# Altium schematic sheet LOAD.SchDoc: =DocumentName
size 297 x 209 mm; CompanyName: "AS Manufacturing" LLC; Organization: "AS Manufacturing" LLC; Address1: 5 Sklyarenka St.; Address2: Kyiv 04073; Address3: Ukraine; Address4: https://ajax.systems/en/; DocumentNumber: 2; SheetNumber: 2; SheetTotal: 7; Template_version: 1.0.1
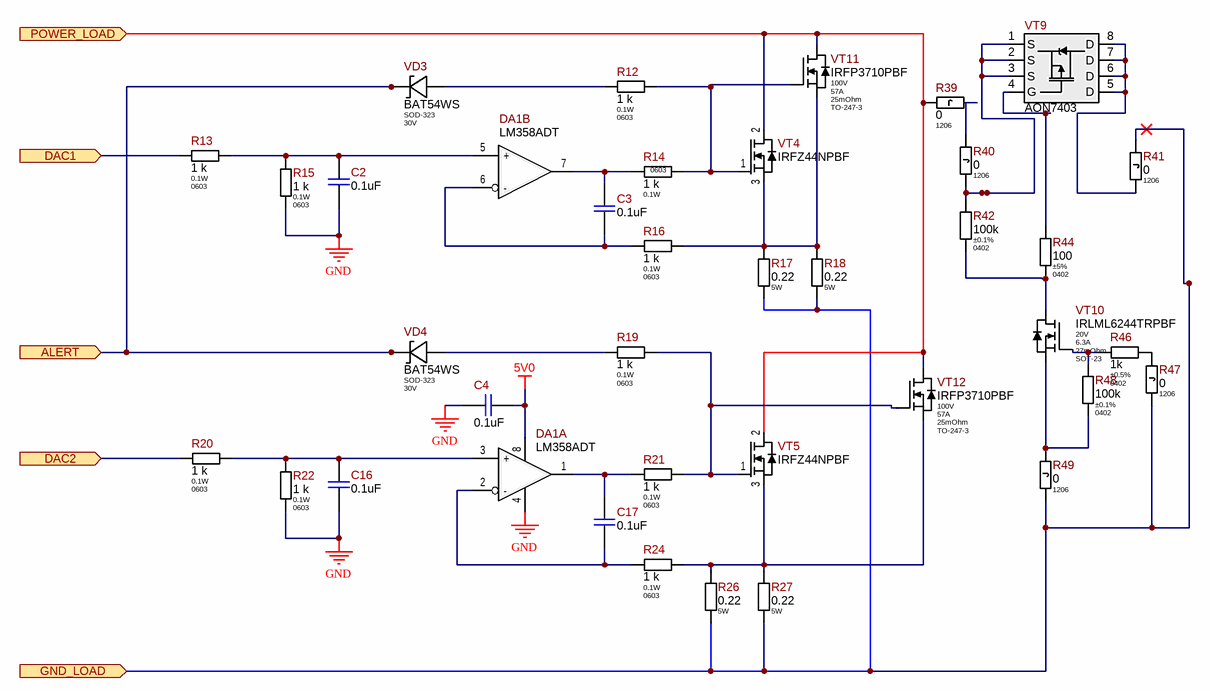
[diagram p0: LOAD.SchDoc]

## Parts
C2  0.1uF  [C0603(1608)]
C3  0.1uF  [C0603(1608)]
C4  0.1uF  [C0603(1608)]
C16  0.1uF  [C0603(1608)]
C17  0.1uF  [C0603(1608)]
DA1  LM358ADT  [SOIC8]  (parts A,B of 2)
R12  1 k  Power Rating: 0.1W  Package/Case: 0603  [R0603]
R13  1 k  Power Rating: 0.1W  Package/Case: 0603  [R0603]
R14  1 k  Power Rating: 0.1W  Package/Case: 0603  [R0603]
R15  1 k  Power Rating: 0.1W  Package/Case: 0603  [R0603]
R16  1 k  Power Rating: 0.1W  Package/Case: 0603  [R0603]
R17  0.22  Power Rating: 5W  [R5W]
R18  0.22  Power Rating: 5W  [R5W]
R19  1 k  Power Rating: 0.1W  Package/Case: 0603  [R0603]
R20  1 k  Power Rating: 0.1W  Package/Case: 0603  [R0603]
R21  1 k  Power Rating: 0.1W  Package/Case: 0603  [R0603]
R22  1 k  Power Rating: 0.1W  Package/Case: 0603  [R0603]
R24  1 k  Power Rating: 0.1W  Package/Case: 0603  [R0603]
R26  0.22  Power Rating: 5W  [R5W]
R27  0.22  Power Rating: 5W  [R5W]
R39  Package: 1206  [R_ANY_CHIP_1206_MED]  (hidden comment: 0)
R40  Package: 1206  [R_ANY_CHIP_1206_MED]  (hidden comment: 0)
R41  Package: 1206  [R_ANY_CHIP_1206_MED]  (hidden comment: 0)
R42  Tolerance: ±0.1%  Package: 0402  [R_ANY_CHIP_0402_MED]  (hidden comment: 100k)
R44  Tolerance: ±5%  Package: 0402  [R_ANY_CHIP_0402_MED]  (hidden comment: 100)
R46  Tolerance: ±0.5%  Package: 0402  [R_ANY_CHIP_0402_MED]  (hidden comment: 1k)
R47  Package: 1206  [R_ANY_CHIP_1206_MED]  (hidden comment: 0)
R48  Tolerance: ±0.1%  Package: 0402  [R_ANY_CHIP_0402_MED]  (hidden comment: 100k)
R49  Package: 1206  [R_ANY_CHIP_1206_MED]  (hidden comment: 0)
VD3  BAT54WS  Package: SOD-323  Voltage: 30V  [SOD-323_MED]
VD4  BAT54WS  Package: SOD-323  Voltage: 30V  [SOD-323_MED]
VT4  IRFZ44NPBF  [TO-220]
VT5  IRFZ44NPBF  [TO-220]
VT9  AON7403  [DFN3X3]
VT10  Part Number: IRLML6244TRPBF  Vds: 20V  Id: 6.3A  Rds: 27mOhm  Package: SOT-23  [SOT-23_MED]  (hidden comment: IRLML6244)
VT11  Vds: 100V  Id: 57A  Rds: 25mOhm  [TO-247-3]  (hidden comment: IRFP3710PBF)
VT12  Vds: 100V  Id: 57A  Rds: 25mOhm  [TO-247-3]  (hidden comment: IRFP3710PBF)

## Ports
ALERT (in), DAC1 (in), DAC2 (in), GND_LOAD (in), POWER_LOAD (in)

## Nets
5V0: C4.1 DA1.8(V+)
GND: C2.2 C4.2 C16.2 DA1.4(V-) R15.1 R22.1
ALERT: VD3.CA VD4.CA ; port ALERT
DAC1: R13.1 ; port DAC1
DAC2: R20.1 ; port DAC2
GND_LOAD: R17.1 R18.1 R26.1 R27.1 R41.1 R47.2 R49.2 ; port GND_LOAD
POWER_LOAD: R39.1 VT4.2(D) VT5.2(D) VT11.2(D) VT12.2(D) ; port POWER_LOAD
NetC2_1: C2.1 DA1.5(+) R13.2 R15.2
NetC3_1: C3.1 DA1.7(Out) R14.1
NetC3_2: C3.2 DA1.6(-) R16.1
NetC16_1: C16.1 DA1.3(+) R20.2 R22.2
NetC17_1: C17.1 DA1.1(Out) R21.1
NetC17_2: C17.2 DA1.2(-) R24.1
NetR12_1: R12.1 VD3.AN
NetR12_2: R12.2 R14.2 VT4.1(G) VT11.1(G)
NetR16_2: R16.2 R17.2 R18.2 VT4.3(S) VT11.3(S)
NetR19_1: R19.1 VD4.AN
NetR19_2: R19.2 R21.2 VT5.1(G) VT12.1(G)
NetR24_2: R24.2 R26.2 R27.2 VT5.3(S) VT12.3(S)
NetR39_2: R39.2 R40.1
NetR40_2: R40.2 R42.1 VT9.1(S) VT9.2(S) VT9.3(S)
NetR41_2: R41.2 VT9.5(D) VT9.6(D) VT9.7(D) VT9.8(D)
NetR42_2: R42.2 R44.2 VT10.3(D)
NetR44_1: R44.1 VT9.4(G)
NetR46_1: R46.1 R47.1
NetR46_2: R46.2 R48.1 VT10.1(G)
NetR48_2: R48.2 R49.1 VT10.2(S)

## Notes on the sheet
- 1
- 2
- 3
- 4
- 5
- 6
- C
- D
- E
- F
- Назва проекту
- Мова
- UA
- Розробник
- Формат
- A4
- Версія
- Дата
- Лист
- /

## Library data of the parts
C2-C4 C16 C17 = 0.1uF  50V C0603: CAP CER 0.1UF 50V X7R 0603; Manufacturer: Samsung Electro-Mechanics; Manufacturer P/N: CL10B104KB8WPNC; Name Component: Capacitor Ceramic; Tolerance: ±10%; Operation Temperature: -55°C ~ 125°C; Library Path 1: Capacitors.SchLib; Notes: 06035C104K4T4A, 06035C104K4T2A; Part Number: 0.1uF  50V C0603; Value: 0.1uF; Temperature Coefficient: X7R; Power (V/A): 50V; Package/Case: C0603; Supplier Part Number 1: 1276-6854-2-ND; ComponentLink1Description: Datasheet; Supplier 1: Digi-key; ComponentLink1URL: https://www.samsungsem.com/resources/file/global/support/product_catalog/MLCC.pdf
DA1 = LM358ADT: IC OPAMP GP 2 CIRCUIT 8SOIC  1.1 MHz   3V...30V; Manufacturer: Texas Instruments; Manufacturer P/N: LM358ADR; Name Component: Comparators; Operation Temperature: 0°C ~ 70°C; Power (V/A): 3V ~ 30V; Library Path 1: Integrated Circuit.SchLib; ComponentLink1URL: https://www.st.com/content/ccc/resource/technical/document/datasheet/61/46/87/01/98/ed/44/c5/CD00000464.pdf/files/CD00000464.pdf/jcr:content/translations/en.CD00000464.pdf; ComponentLink1Description: Datasheet; Part Number: LM358ADT; Value: LM358ADT; Package/Case: 8-SOIC; Supplier 1: Kosmodrom; Supplier Part Number 1: LM358ADT
R12-R16 R19-R22 R24 = 1 k  R0603: RES SMD 1 k OHM  ±1% 1/10W 0603; Name Component: Resistror; Operation Temperature: -55℃ to 155℃; Temperature Coefficient: ±100 ppm/°C; Library Path 1: Resistor.SchLib; Part Number: 1 k  R0603; Value: 1 k; Tolerance: ±1%
R17 R18 R26 R27 = 47  RES_5W: Resistror 47 OHM  ±10% AXIAL  9.00mm x 22.00mm; Operation Temperature: -55℃ to 155℃; Temperature Coefficient: ±100 ppm/°C; Library Path 1: Resistor.SchLib; Part Number: 47  RES_5W; Name Component: Resistror; Value: 0.22; Tolerance: ±10%
R39-R41 R47 R49 = RCS12060000Z0EA: 0 Ohms Jumper, 1/2W 1206 Thick Film Resistor; Manufacturer: Vishay; Tolerance: 0.5%; Ajax_1C_ID: 28766; Ajax_1C_PN: 0R Jumper 1206 1/2W Resistors SMD RoHS; Ajax_1С_Status: Mass Production; Component Status: Released; Power Rating: 0.5W; Voltage: NONE; GUID_1C: 39e965f6-9d2d-11eb-ab70-0050569f2651; Value: 0; Part Number: RCS12060000Z0EA; Part Type: Thick Film; Component Type: SMD; Temperature Stability: NONE; Temperature Range: -55°C ~ 155°C; ComponentLink1URL: https://eu.mouser.com/datasheet/2/427/rcse3-1761771.pdf; Supplier 1: Mouser; Supplier Part Number 1: 71-RCS12060000Z0EA; Replacement: NONE; Price: 0.023; ComponentLink1Description: Datasheet
R42 R48 = WF04U1003BTL: 100 kOhms ±0.1%, 1/16W 0402 Thin Film Resistor; Manufacturer: Walsin Technology Corporation; Ajax_1C_ID: 137562; Ajax_1C_PN: 100k 0.1% 0402 62.5mW WF04U1003BTL Walsin Thin Film Resistors SMD RoHS; Ajax_1С_Status: Substitution; Component Status: Review; Power Rating: 0.062W; Voltage: 50V; Temperature Stability: ±25ppm/°C; Replacement: NONE; GUID_1C: d33922d2-2bd8-11f0-b984-00505699fadc; Value: 100k; Part Number: WF04U1003BTL; Part Type: Thin Film; Component Type: SMD; Temperature Range: -55°C ~ 155°C; ComponentLink1URL: https://www.passivecomponent.com/wp-content/uploads/thin_film/ASC_WFxxT&U.pdf; Supplier 1: Digi-Key; Supplier Part Number 1: 1292-WF04U1003BTLTR-ND; Price: 0.109; ComponentLink1Description: Datasheet
R44 = RC0402JR-07100RL: 100 Ohms ±5% 1/16W 0402 Thick Film Resistor; Manufacturer: Yageo; Ajax_1C_ID: 4879; Ajax_1C_PN: 100R 5% 0402 Resistors SMD RoHS; Ajax_1С_Status: Mass Production; Component Status: Released; Power Rating: 0.062W; Voltage: 50V; Temperature Stability: ±100ppm/°C; Replacement: NONE; GUID_1C: 955d0a6e-1239-11e4-b679-a45d36c4a9e5; Value: 100; Part Number: RC0402JR-07100RL; Part Type: Thick Film; Component Type: SMD; Temperature Range: -55°C ~ 155°C; ComponentLink1URL: https://eu.mouser.com/datasheet/2/447/PYu_RC_Group_51_RoHS_L_10-1664068.pdf; Supplier 1: Digi-Key; Supplier Part Number 1: 311-100JRTR-ND; Price: 0.00250459; ComponentLink1Description: Datasheet
R46 = RC0402DR-071KL: 1 kOhms ±0.5% 1/16W 0402 Thick Film Resistor; Manufacturer: Yageo; Ajax_1C_ID: 54619; Ajax_1C_PN: 1k 0.5% 0402 RC0402DR-071KL Resistors SMD RoHS; Ajax_1С_Status: Mass Production; Component Status: Released; Power Rating: 0.062W; Voltage: 50V; Temperature Stability: ±100ppm/°C; Replacement: NONE; GUID_1C: a470e21a-6423-11ed-a366-005056994834; Value: 1k; Part Number: RC0402DR-071KL; Part Type: Thick Film; Component Type: SMD; Temperature Range: -55°C ~ 155°C; ComponentLink1URL: https://www.yageo.com/upload/media/product/productsearch/datasheet/rchip/PYu-RC_Group_51_RoHS_L_12.pdf; Supplier 1: Digi-Key; Supplier Part Number 1: 13-RC0402DR-071KLTR-ND; Price: 0.015; ComponentLink1Description: Datasheet
VD3 VD4 = BAT54WS-7-F: Diode Schottky 30V 100mA, Fast Recovery 5ns, Low Leakage 2uA, SOD-323; Manufacturer: Diodes Incorporated; Ajax_1C_ID: 121513; Ajax_1C_PN: BAT54WS-7-F діод; Ajax_1С_Status: Mass Production; Component Status: Released; Marking: L9; Standard Lead Time: 8 Weeks; Vf: 500mV @ 30mA; Replacement: NONE; GUID_1C: e8a592fc-b25b-11ef-b620-0050569991a1; Part Number: BAT54WS-7-F; Supplier 1: Mouser; Supplier Part Number 1: 621-BAT54WS-F; ComponentLink1Description: Datasheet; ComponentLink1URL: https://eu.mouser.com/datasheet/2/115/DIOD_S_A0004140728_1-2542383.pdf; Part Type: Schottky; Component Type: SMD; Current: 100mA; Temperature Range: -65°C ~ 150°C; Price: 0.07452906
VT4 VT5 = IRFZ44NPBF: MOSFET N-CH 55V 49A TO220AB; Manufacturer: Infineon Technologies; Name Component: Transistor; Operation Temperature: -55°C ~ 175°C (TJ); Power Rating: 49A 55 В; Library Path 1: Transistors.SchLib; Part Number: IRFZ44NPBF; Value: IRFZ44NPBF; Package/Case: TO-220; Manufacturer P/N: IRFZ44NPBF; Supplier 1: Digi-key; Supplier Part Number 1: IRFZ44NPBF-ND; ComponentLink1Description: Datasheet; ComponentLink1URL: https://www.infineon.com/dgdl/irfz44npbf.pdf?fileId=5546d462533600a40153563b3a9f220d
VT9 = AON7403: P-Channel 30 V 11A (Ta), 29A (Tc) 3.1W (Ta), 25W (Tc) Surface Mount 8-DFN-EP (3x3); Manufacturer: Alpha & Omega Semiconductor Inc.; Name Component: Transistor; Operation Temperature: -55°C ~ 150°C (TJ); Power Rating: 30V 15A; Library Path 1: Transistors.SchLib; Part Number: AON7403; ComponentLink1URL: https://imrad.com.ua/userdata/modules/productFiles/XwMaVOEl_AON7403_ao.pdf; ComponentLink1Description: Datasheet; Supplier 1: Digi-key; Supplier Part Number 1: 785-1581-2-ND; Value: AON7403; Package/Case: DFN3x3; Manufacturer P/N: AON7403
VT10 = IRLML6244TRPBF: 20V, 6.3A max N-Channel HEXFET MOSFET, 21mOhm @ Vgs = 4.5V; Manufacturer: Infineon Technologies; Ajax_1C_ID: 5903; Ajax_1C_PN: IRLML6244TRPBF. польовий транзистор; Ajax_1С_Status: Mass Production; Component Status: Released; Standard Lead Time: 15 Weeks; Replacement: NONE; GUID_1C: 6032e646-a6d2-11e4-9c1d-a45d36c4a9e5; Part Type: N-Channel; Component Type: SMD; Temperature Range: -55°C ~ 150°C; ComponentLink1URL: https://eu.mouser.com/datasheet/2/196/Infineon_IRLML6244_DataSheet_v01_01_EN-3363560.pdf; Supplier 1: Digi-Key; Supplier Part Number 1: IRLML6244TRPBFTR-ND; Price: 0.053; ComponentLink1Description: Datasheet
VT11 VT12 = IRFP3710PBF: 100V, 57A max N-Channel HEXFET Power MOSFET, 25mOhm @ Vgs = 10V; Manufacturer: Infineon Technologies; Ajax_1C_ID: 182262; Ajax_1C_PN: IRFP3710PBF N-Channel 100V 57A TO-247-3 Infineon Technologies RoHS; Ajax_1С_Status: RND Only; Component Status: Review; Standard Lead Time: 35 Weeks; Replacement: NONE; Part Number: IRFP3710PBF; Package: TO-247-3; Part Type: N-Channel; Component Type: PTH; Temperature Range: -55°C ~ 175°C; ComponentLink1URL: https://www.infineon.com/assets/row/public/documents/24/49/infineon-irfp3710-datasheet-en.pdf; Supplier 1: Digi-Key; Supplier Part Number 1: IRFP3710PBF-ND; Price: NONE; ComponentLink1Description: Datasheet